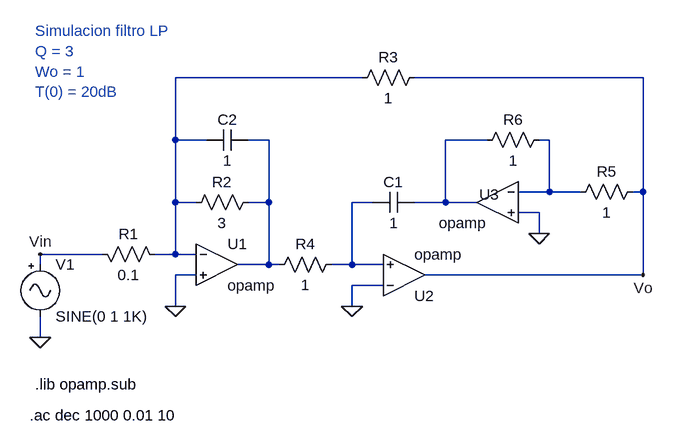
[diagram p0: schematic TS2.asc]
TS2.asc, the LTspice schematic file:
Version 4
SHEET 1 880 680
WIRE 112 -240 -176 -240
WIRE 544 -240 192 -240
WIRE -176 -144 -176 -240
WIRE -128 -144 -176 -144
WIRE -32 -144 -64 -144
WIRE 304 -144 240 -144
WIRE 400 -144 384 -144
WIRE 400 -64 400 -144
WIRE 400 -64 352 -64
WIRE 448 -64 400 -64
WIRE 544 -64 544 -240
WIRE 544 -64 528 -64
WIRE -176 -48 -176 -144
WIRE -144 -48 -176 -48
WIRE -32 -48 -32 -144
WIRE -32 -48 -64 -48
WIRE 128 -48 96 -48
WIRE 240 -48 240 -144
WIRE 240 -48 192 -48
WIRE 288 -48 240 -48
WIRE 384 -32 352 -32
WIRE 384 0 384 -32
WIRE -288 32 -384 32
WIRE -176 32 -176 -48
WIRE -176 32 -208 32
WIRE -144 32 -176 32
WIRE -384 48 -384 32
WIRE -32 48 -32 -48
WIRE -32 48 -80 48
WIRE -16 48 -32 48
WIRE 96 48 96 -48
WIRE 96 48 64 48
WIRE 144 48 96 48
WIRE -144 64 -176 64
WIRE 544 64 544 -64
WIRE 544 64 208 64
WIRE 144 80 96 80
WIRE -176 112 -176 64
WIRE 96 112 96 80
WIRE -384 160 -384 128
FLAG -176 112 0
FLAG 96 112 0
FLAG 384 0 0
FLAG -384 160 0
FLAG -384 32 Vin
FLAG 544 64 Vo
SYMBOL res -192 48 M270
WINDOW 0 32 56 VTop 2
WINDOW 3 0 56 VBottom 2
SYMATTR InstName R1
SYMATTR Value 0.1
SYMBOL res -160 -32 R270
WINDOW 0 32 56 VTop 2
WINDOW 3 0 56 VBottom 2
SYMATTR InstName R2
SYMATTR Value 3
SYMBOL res 208 -256 R90
WINDOW 0 0 56 VBottom 2
WINDOW 3 32 56 VTop 2
SYMATTR InstName R3
SYMATTR Value 1
SYMBOL res 80 32 R90
WINDOW 0 0 56 VBottom 2
WINDOW 3 32 56 VTop 2
SYMATTR InstName R4
SYMATTR Value 1
SYMBOL res 544 -80 R90
WINDOW 0 0 56 VBottom 2
WINDOW 3 32 56 VTop 2
SYMATTR InstName R5
SYMATTR Value 1
SYMBOL res 400 -160 R90
WINDOW 0 0 56 VBottom 2
WINDOW 3 32 56 VTop 2
SYMATTR InstName R6
SYMATTR Value 1
SYMBOL cap 192 -64 R90
WINDOW 0 0 32 VBottom 2
WINDOW 3 32 32 VTop 2
SYMATTR InstName C1
SYMATTR Value 1
SYMBOL cap -64 -160 R90
WINDOW 0 0 32 VBottom 2
WINDOW 3 32 32 VTop 2
SYMATTR InstName C2
SYMATTR Value 1
SYMBOL Opamps/opamp -112 -16 R0
SYMATTR InstName U1
SYMBOL Opamps/opamp 176 128 M180
SYMATTR InstName U2
SYMBOL Opamps/opamp 320 -112 M0
WINDOW 0 -3 52 Left 2
SYMATTR InstName U3
SYMBOL Misc/signal -384 32 R0
SYMATTR InstName V1
SYMATTR Value2 AC 1
TEXT -400 280 Left 2 !.ac dec 1000 0.01 10
TEXT -392 232 Left 2 !.lib opamp.sub
TEXT -392 -312 Left 2 ;Simulacion filtro LP\nQ = 3\nWo = 1\nT(0) = 20dB

The netlist it stands for:
* TS2.asc
R1 N001 Vin 0.1
R2 N001 N002 3
R3 Vo N001 1
R4 N005 N002 1
R5 Vo N004 1
R6 N004 N003 1
C1 N003 N005 1
C2 N002 N001 1
XU1 N001 0 N002 opamp Aol=100K GBW=10Meg  ; pins invin noninvin out
XU2 0 N005 Vo opamp Aol=100K GBW=10Meg  ; pins invin noninvin out
XU3 N004 0 N003 opamp Aol=100K GBW=10Meg  ; pins invin noninvin out
V1 Vin 0 SINE(0 1 1K) AC 1
.ac dec 1000 0.01 10
.lib opamp.sub
* Simulacion filtro LP
* Q = 3
* Wo = 1
* T(0) = 20dB
.backanno
.end